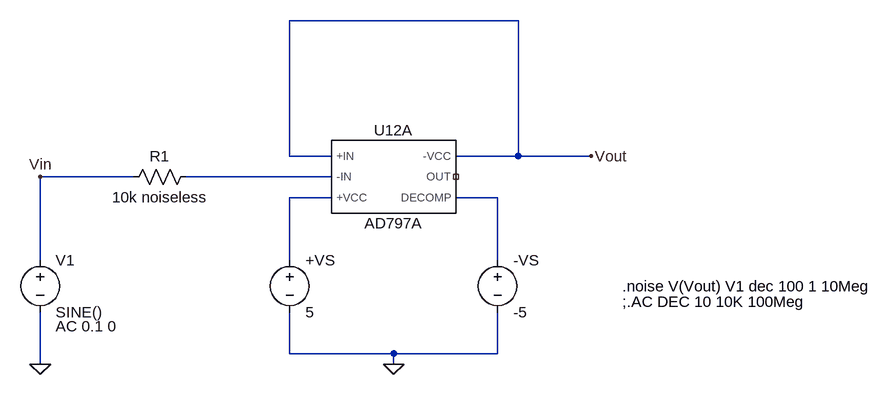
[diagram p0: schematic ad797a_inoisevalidation_noninvertinginput.asc]
ad797a_inoisevalidation_noninvertinginput.asc, the LTspice schematic file:
Version 4
SHEET 1 1180 680
WIRE 624 128 272 128
WIRE 272 336 272 128
WIRE 336 336 272 336
WIRE 624 336 624 128
WIRE 624 336 528 336
WIRE 736 336 624 336
WIRE 32 368 -112 368
WIRE 336 368 112 368
WIRE 336 400 272 400
WIRE 592 400 528 400
WIRE -112 496 -112 368
WIRE 272 496 272 400
WIRE 592 496 592 400
WIRE 272 640 272 576
WIRE 432 640 272 640
WIRE 592 640 592 576
WIRE 592 640 432 640
WIRE -112 656 -112 576
WIRE 432 656 432 640
FLAG 432 656 0
FLAG -112 656 0
FLAG 736 336 Vout
FLAG -112 368 Vin
SYMBOL AutoGenerated/AD797A 432 368 R0
SYMATTR InstName U12A
SYMBOL voltage 272 480 R0
SYMATTR InstName +VS
SYMATTR Value 5
SYMATTR SpiceLine Rser=0
SYMBOL voltage 592 480 R0
SYMATTR InstName -VS
SYMATTR Value -5
SYMATTR SpiceLine Rser=0
SYMBOL voltage -112 480 R0
WINDOW 123 24 118 Left 2
SYMATTR Value2 AC 0.1 0
SYMATTR InstName V1
SYMATTR Value SINE()
SYMBOL res 128 352 R90
WINDOW 0 0 56 VBottom 2
WINDOW 3 32 56 VTop 2
SYMATTR InstName R1
SYMATTR Value 10k noiseless
TEXT 784 560 Left 2 !;.AC DEC 10 10K 100Meg
TEXT 784 536 Left 2 !.noise V(Vout) V1 dec 100 1 10Meg

The netlist it stands for:
* ad797a_inoisevalidation_noninvertinginput.asc
XU12A Vout N001 N002 Vout NC_01 N003 AD797A  ; pins +IN -IN +VCC -VCC OUT DECOMP
V§+VS N002 0 5 Rser=0
V§-VS N003 0 -5 Rser=0
V1 Vin 0 SINE() AC 0.1 0
R1 N001 Vin 10k noiseless
;.AC DEC 10 10K 100Meg
.noise V(Vout) V1 dec 100 1 10Meg
.lib /Users/shawn/Downloads/tdmspice/opamps/ad797a/ad797a.cir
.backanno
.end